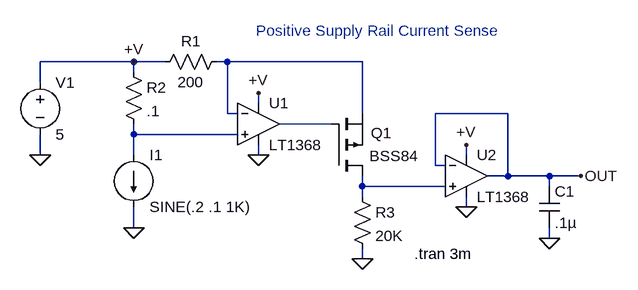
[diagram p0: schematic 1368.asc]
1368.asc, the LTspice schematic file:
Version 4
SHEET 1 1388 720
WIRE 32 16 -112 16
WIRE 80 16 32 16
WIRE 176 16 160 16
WIRE 384 16 176 16
WIRE 32 32 32 16
WIRE -112 48 -112 16
WIRE 224 80 224 64
WIRE 176 96 176 16
WIRE 192 96 176 96
WIRE 384 96 384 16
WIRE 608 96 496 96
WIRE 336 112 256 112
WIRE 32 128 32 112
WIRE 192 128 32 128
WIRE -112 160 -112 128
WIRE 32 160 32 128
WIRE 224 160 224 144
WIRE 544 160 544 144
WIRE 496 176 496 96
WIRE 512 176 496 176
WIRE 608 192 608 96
WIRE 608 192 576 192
WIRE 672 192 608 192
WIRE 720 192 672 192
WIRE 384 208 384 192
WIRE 512 208 384 208
WIRE 672 208 672 192
WIRE 384 224 384 208
WIRE 544 240 544 224
WIRE 32 272 32 240
WIRE 672 288 672 272
WIRE 384 320 384 304
FLAG -112 160 0
FLAG 224 64 +V
FLAG 720 192 OUT
FLAG 32 272 0
FLAG 224 160 0
FLAG 32 16 +V
FLAG 384 320 0
FLAG 544 144 +V
FLAG 544 240 0
FLAG 672 288 0
SYMBOL voltage -112 32 R0
SYMATTR InstName V1
SYMATTR Value 5
SYMBOL res 176 0 R90
WINDOW 0 0 56 VBottom 0
WINDOW 3 32 56 VTop 0
SYMATTR InstName R1
SYMATTR Value 200
SYMBOL pmos 336 192 M180
WINDOW 0 61 66 Left 0
WINDOW 3 59 31 Left 0
SYMATTR InstName Q1
SYMATTR Value BSS84
SYMBOL current 32 160 R0
WINDOW 123 0 0 Left 0
WINDOW 39 0 0 Left 0
SYMATTR InstName I1
SYMATTR Value SINE(.2 .1 1K)
SYMBOL res 16 16 R0
SYMATTR InstName R2
SYMATTR Value .1
SYMBOL res 368 208 R0
SYMATTR InstName R3
SYMATTR Value 20K
SYMBOL cap 656 208 R0
SYMATTR InstName C1
SYMATTR Value .1µ
SYMBOL opamps\\LT1368 224 48 R0
SYMATTR InstName U1
SYMBOL opamps\\LT1368 544 128 R0
SYMATTR InstName U2
TEXT 464 312 Left 0 !.tran 3m 
TEXT 408 -16 Bottom 0 ;Positive Supply Rail Current Sense

The netlist it stands for:
* 1368.asc
V1 +V 0 5
R1 N001 +V 200
M§Q1 N004 N002 N001 N001 BSS84
I1 N003 0 SINE(.2 .1 1K)
R2 +V N003 .1
R3 N004 0 20K
C1 OUT 0 .1µ
XU1 N003 N001 +V 0 N002 LT1368  ; pins In+ In- V+ V- OUT
XU2 N004 OUT +V 0 OUT LT1368  ; pins In+ In- V+ V- OUT
.model NMOS NMOS
.model PMOS PMOS
.lib standard.mos
.tran 3m
* Positive Supply Rail Current Sense
.backanno
.end